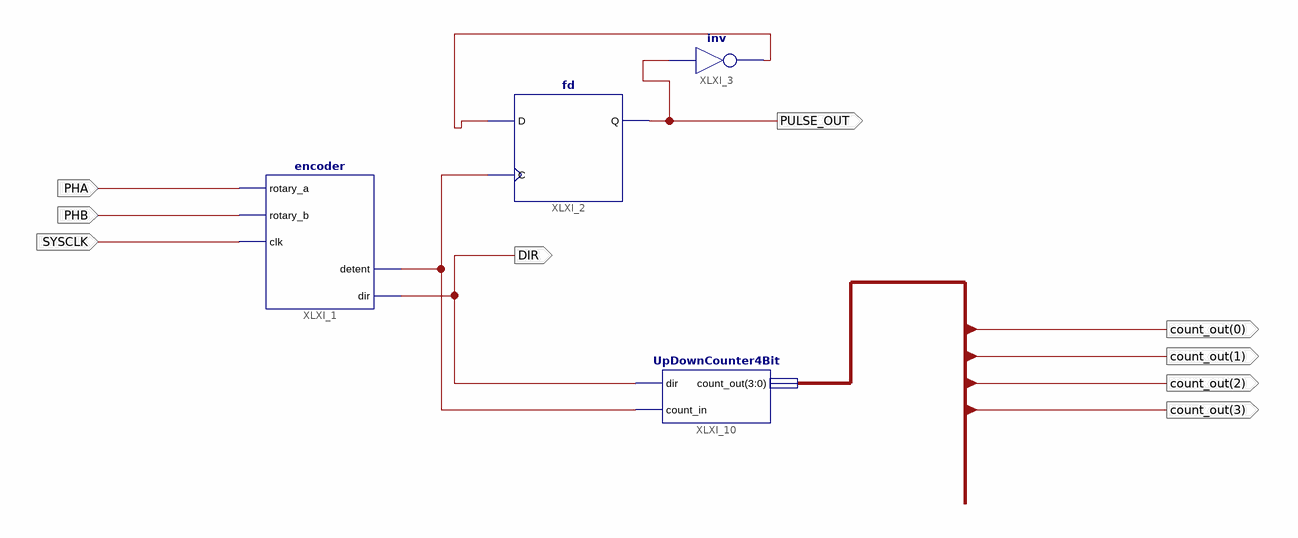
[diagram p0: schematic sheet 1]
// Xilinx ISE schematic TOPLEVEL.sch (spartan3e) as structural Verilog: 4 symbols, 9 ports
module TOPLEVEL (
  input  PHA,
  input  PHB,
  input  SYSCLK,
  output [3:0] count_out,
  output PULSE_OUT,
  output DIR
);

  wire XLXN_6, XLXN_33;

  encoder XLXI_1 (.rotary_a(PHA), .rotary_b(PHB), .clk(SYSCLK), .detent(XLXN_33), .dir(DIR));
  fd XLXI_2 (.C(XLXN_33), .D(XLXN_6), .Q(PULSE_OUT));
  not XLXI_3 (XLXN_6, PULSE_OUT);
  UpDownCounter4Bit XLXI_10 (.dir(DIR), .count_in(XLXN_33), .count_out(count_out));
endmodule
